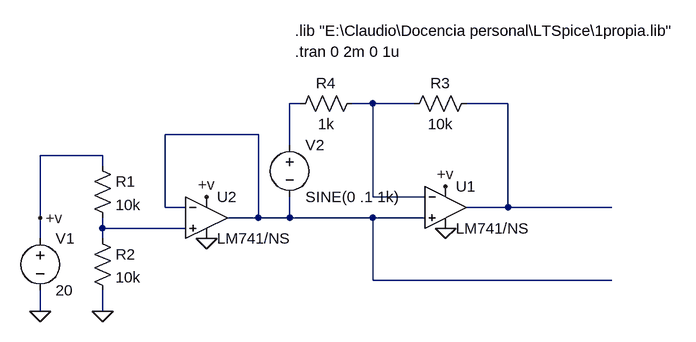
[diagram p0: schematic ao fuente simple.asc]
ao fuente simple.asc, the LTspice schematic file:
Version 4
SHEET 1 1076 680
WIRE 160 -384 144 -384
WIRE 272 -384 240 -384
WIRE 336 -384 272 -384
WIRE 480 -384 416 -384
WIRE 96 -336 -48 -336
WIRE 144 -320 144 -384
WIRE -144 -304 -240 -304
WIRE -144 -288 -144 -304
WIRE 272 -240 272 -384
WIRE 352 -240 272 -240
WIRE -48 -224 -48 -336
WIRE -16 -224 -48 -224
WIRE 480 -224 480 -384
WIRE 480 -224 416 -224
WIRE 640 -224 480 -224
WIRE -240 -208 -240 -304
WIRE 96 -208 96 -336
WIRE 96 -208 48 -208
WIRE 144 -208 144 -240
WIRE 144 -208 96 -208
WIRE 272 -208 144 -208
WIRE 352 -208 272 -208
WIRE -144 -192 -144 -208
WIRE -16 -192 -144 -192
WIRE -240 -176 -240 -208
WIRE -144 -176 -144 -192
WIRE 272 -112 272 -208
WIRE 640 -112 272 -112
WIRE -240 -64 -240 -96
WIRE -144 -64 -144 -96
FLAG -240 -64 0
FLAG -240 -208 +v
FLAG 384 -256 +v
FLAG 384 -192 0
FLAG 16 -240 +v
FLAG 16 -176 0
FLAG -144 -64 0
SYMBOL OpAmps\\opamp2 384 -288 R0
SYMATTR InstName U1
SYMATTR Value LM741/NS
SYMBOL voltage -240 -192 R0
WINDOW 123 0 0 Left 0
WINDOW 39 0 0 Left 0
SYMATTR InstName V1
SYMATTR Value 20
SYMBOL OpAmps\\opamp2 16 -272 R0
SYMATTR InstName U2
SYMATTR Value LM741/NS
SYMBOL res -160 -304 R0
SYMATTR InstName R1
SYMATTR Value 10k
SYMBOL res -160 -192 R0
SYMATTR InstName R2
SYMATTR Value 10k
SYMBOL res 432 -400 R90
WINDOW 0 0 56 VBottom 2
WINDOW 3 32 56 VTop 2
SYMATTR InstName R3
SYMATTR Value 10k
SYMBOL res 256 -400 R90
WINDOW 0 0 56 VBottom 2
WINDOW 3 32 56 VTop 2
SYMATTR InstName R4
SYMATTR Value 1k
SYMBOL voltage 144 -336 R0
WINDOW 123 0 0 Left 0
WINDOW 39 0 0 Left 0
SYMATTR InstName V2
SYMATTR Value SINE(0 .1 1k)
TEXT 152 -496 Left 2 !.lib "E:\\Claudio\\Docencia personal\\LTSpice\\1propia.lib"
TEXT 152 -464 Left 2 !.tran 0 2m 0 1u

The netlist it stands for:
* ao fuente simple.asc
XU1 N004 N002 +v 0 N003 LM741/NS  ; pins In+ In- V+ V- OUT
V1 +v 0 20
XU2 N005 N004 +v 0 N004 LM741/NS  ; pins In+ In- V+ V- OUT
R1 +v N005 10k
R2 N005 0 10k
R3 N003 N002 10k
R4 N002 N001 1k
V2 N001 N004 SINE(0 .1 1k)
.lib "E:\Claudio\Docencia personal\LTSpice\1propia.lib"
.tran 0 2m 0 1u
.backanno
.end